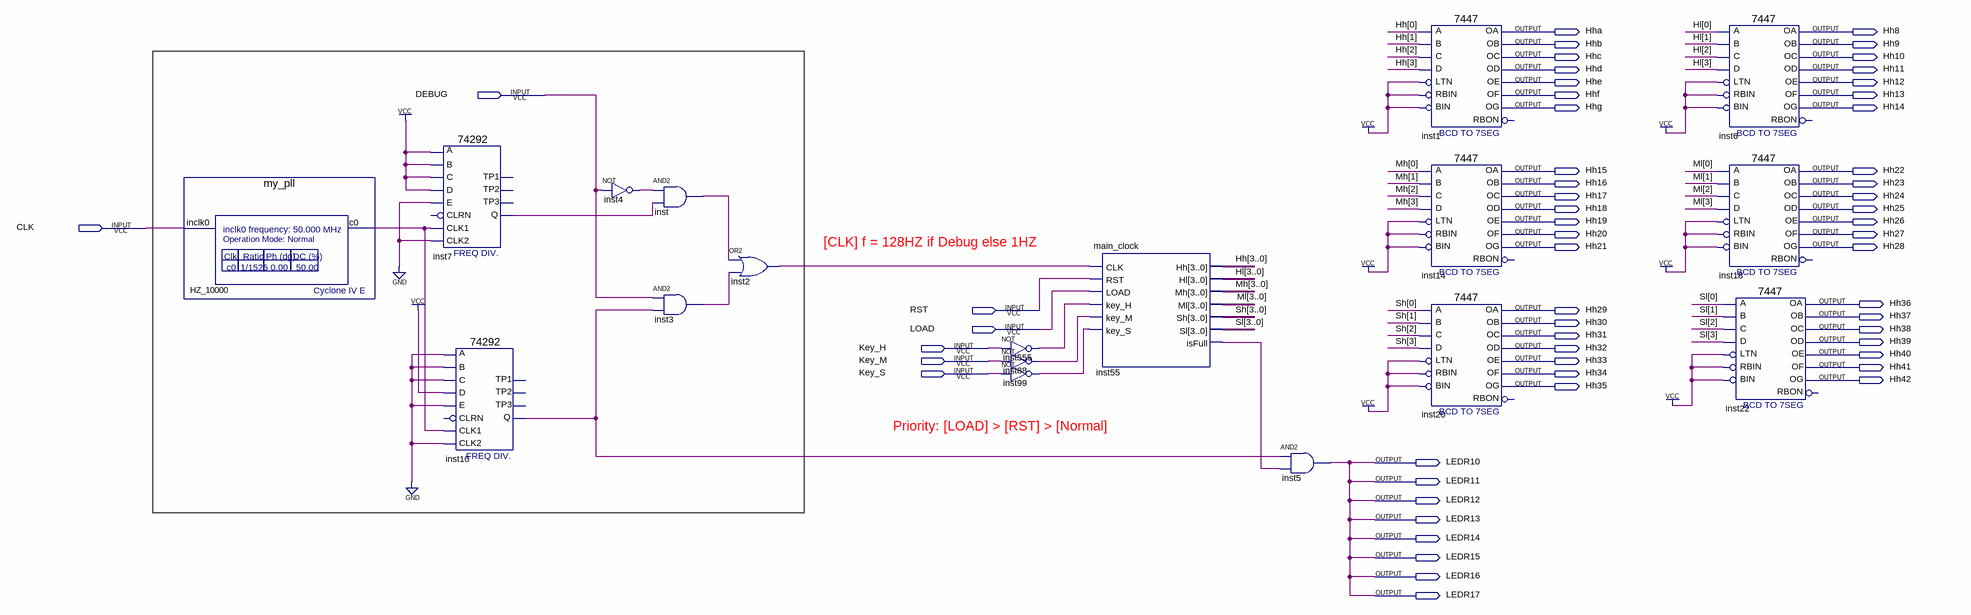
[diagram p0: schematic sheet]
// Quartus schematic E3_DigtialClock.bdf as structural Verilog: 18 symbols, 57 pins
module E3_DigtialClock (
  input  DEBUG,
  input  CLK,
  input  RST,
  input  LOAD,
  input  Key_H,
  input  Key_M,
  input  Key_S,
  output Hha,
  output Hh8,
  output Hhb,
  output Hh9,
  output Hhc,
  output Hh10,
  output Hhd,
  output Hh11,
  output Hhe,
  output Hh12,
  output Hhf,
  output Hh13,
  output Hhg,
  output Hh14,
  output Hh15,
  output Hh22,
  output Hh16,
  output Hh23,
  output Hh17,
  output Hh24,
  output Hh18,
  output Hh25,
  output Hh19,
  output Hh26,
  output Hh20,
  output Hh27,
  output Hh21,
  output Hh28,
  output Hh36,
  output Hh29,
  output Hh37,
  output Hh30,
  output Hh38,
  output Hh31,
  output Hh39,
  output Hh32,
  output Hh40,
  output Hh33,
  output Hh41,
  output Hh34,
  output Hh42,
  output Hh35,
  output LEDR10,
  output LEDR11,
  output LEDR12,
  output LEDR13,
  output LEDR14,
  output LEDR15,
  output LEDR16,
  output LEDR17
);

  wire HZ_10000_c0, inst2_out, inst3_out, inst4_out, inst7_q, inst10_q, inst55_isfull, inst88_out,
       inst99_out, inst555_out, inst_out;
  wire [3:0] Hh, Hl, Mh, Ml, Sh, Sl;

  my_pll HZ_10000 (.inclk0(CLK), .c0(HZ_10000_c0));
  \74292  inst7 (
    .A(1'b1), .D(1'b1), .C(1'b1), .B(1'b1), .CLK1(HZ_10000_c0), .E(1'b0), .CLK2(1'b0), .Q(inst7_q));  // open: CLRN, TP2, TP1, TP3
  \74292  inst10 (
    .A(1'b0), .D(1'b1), .C(1'b0), .B(1'b0), .CLK1(HZ_10000_c0), .E(1'b0), .CLK2(1'b0), .Q(inst10_q));  // open: CLRN, TP2, TP1, TP3
  not inst4 (inst4_out, DEBUG);
  and inst (inst_out, inst4_out, inst7_q);
  and inst3 (inst3_out, DEBUG, inst10_q);
  or inst2 (inst2_out, inst_out, inst3_out);
  not inst555 (inst555_out, Key_H);
  not inst88 (inst88_out, Key_M);
  not inst99 (inst99_out, Key_S);
  main_clock inst55 (
    .CLK(inst2_out), .RST(RST), .LOAD(LOAD), .key_H(inst555_out), .key_M(inst88_out), .key_S(inst99_out),
    .Hh(Hh), .Hl(Hl), .Mh(Mh), .Ml(Ml), .Sh(Sh), .Sl(Sl), .isFull(inst55_isfull));
  and inst5 (LEDR10, inst10_q, inst55_isfull);
  \7447  inst1 (
    .LTN(1'b1), .B(Hh[1]), .C(Hh[2]), .D(Hh[3]), .RBIN(1'b1), .BIN(1'b1), .A(Hh[0]), .OB(Hhb), .OC(Hhc),
    .OE(Hhe), .OD(Hhd), .OF(Hhf), .OG(Hhg), .OA(Hha));  // open: RBON
  \7447  inst14 (
    .LTN(1'b1), .B(Mh[1]), .C(Mh[2]), .D(Mh[3]), .RBIN(1'b1), .BIN(1'b1), .A(Mh[0]), .OB(Hh16), .OC(Hh17),
    .OE(Hh19), .OD(Hh18), .OF(Hh20), .OG(Hh21), .OA(Hh15));  // open: RBON
  \7447  inst20 (
    .LTN(1'b1), .B(Sh[1]), .C(Sh[2]), .D(Sh[3]), .RBIN(1'b1), .BIN(1'b1), .A(Sh[0]), .OB(Hh30), .OC(Hh31),
    .OE(Hh33), .OD(Hh32), .OF(Hh34), .OG(Hh35), .OA(Hh29));  // open: RBON
  \7447  inst6 (
    .LTN(1'b1), .B(Hl[1]), .C(Hl[2]), .D(Hl[3]), .RBIN(1'b1), .BIN(1'b1), .A(Hl[0]), .OB(Hh9), .OC(Hh10),
    .OE(Hh12), .OD(Hh11), .OF(Hh13), .OG(Hh14), .OA(Hh8));  // open: RBON
  \7447  inst18 (
    .LTN(1'b1), .B(Ml[1]), .C(Ml[2]), .D(Ml[3]), .RBIN(1'b1), .BIN(1'b1), .A(Ml[0]), .OB(Hh23), .OC(Hh24),
    .OE(Hh26), .OD(Hh25), .OF(Hh27), .OG(Hh28), .OA(Hh22));  // open: RBON
  \7447  inst22 (
    .LTN(1'b1), .B(Sl[1]), .C(Sl[2]), .D(Sl[3]), .RBIN(1'b1), .BIN(1'b1), .A(Sl[0]), .OB(Hh37), .OC(Hh38),
    .OE(Hh40), .OD(Hh39), .OF(Hh41), .OG(Hh42), .OA(Hh36));  // open: RBON

  assign LEDR11 = LEDR10;
  assign LEDR12 = LEDR10;
  assign LEDR13 = LEDR10;
  assign LEDR14 = LEDR10;
  assign LEDR15 = LEDR10;
  assign LEDR16 = LEDR10;
  assign LEDR17 = LEDR10;

  // Notes on the sheet:
  //   [CLK] f = 128HZ if Debug else 1HZ        
  //   Priority: [LOAD] > [RST] > [Normal]       
endmodule
